# Altium schematic sheet Display.SchDoc: Display
size A4; DrawnBy: Mauro De Bruyn; Revision: 1; SheetNumber: 1; SheetTotal: 5; Number: PXL EAI1_2
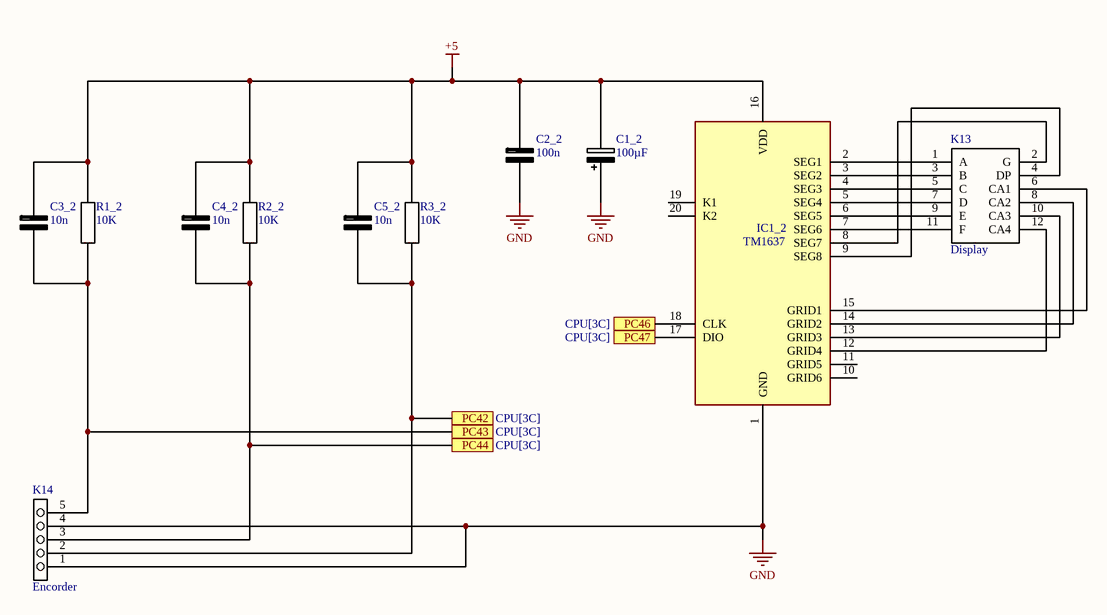
[diagram p0: Display.SchDoc]

## Parts
C1_2  100µF  [CAPPRD350W60D825H1300]
C2_2  100n  [0805]
C3_2  10n  [0805]
C4_2  10n  [0805]
C5_2  10n  [0805]
IC1_2  TM1637  [tm1637]
K13  Display  [HDRV12W64P254_2X6_1524X508X909P]
K14  Encorder  [HDRV5W64P0X254_1X5_1270X254X864P]
R1_2  10K  [0805]
R2_2  10K  [0805]
R3_2  10K  [0805]

## Ports
PC42 (see CPU[3C]), PC43 (see CPU[3C]), PC44 (see CPU[3C]), PC46 (see CPU[3C]), PC47 (see CPU[3C])

## Nets
+5: C1_2.2(-) C2_2.2(-) C3_2.2(-) C4_2.2(-) C5_2.2(-) IC1_2.16(VDD) R1_2.2 R2_2.2 R3_2.2
GND: C1_2.1(+) C2_2.1(+) IC1_2.1(GND) K14.1 K14.4
PC42: C5_2.1(+) K14.2 R3_2.1 ; port PC42
PC43: C3_2.1(+) K14.5 R1_2.1 ; port PC43
PC44: C4_2.1(+) K14.3 R2_2.1 ; port PC44
PC46: IC1_2.18(CLK) ; port PC46
PC47: IC1_2.17(DIO) ; port PC47
NetIC1_2_2: IC1_2.2(SEG1) K13.1(A)
NetIC1_2_3: IC1_2.3(SEG2) K13.3(B)
NetIC1_2_4: IC1_2.4(SEG3) K13.5(C)
NetIC1_2_5: IC1_2.5(SEG4) K13.7(D)
NetIC1_2_6: IC1_2.6(SEG5) K13.9(E)
NetIC1_2_7: IC1_2.7(SEG6) K13.11(F)
NetIC1_2_8: IC1_2.8(SEG7) K13.2(G)
NetIC1_2_9: IC1_2.9(SEG8) K13.4(DP)
NetIC1_2_12: IC1_2.12(GRID4) K13.12(CA4)
NetIC1_2_13: IC1_2.13(GRID3) K13.10(CA3)
NetIC1_2_14: IC1_2.14(GRID2) K13.8(CA2)
NetIC1_2_15: IC1_2.15(GRID1) K13.6(CA1)

Not connected (* = marked no-connect by the designer): IC1_2 10(GRID6) 11(GRID5) 19(K1) 20(K2)

## Library data of the parts
C1_2 = RGA101M1HBK-0811G: Capacitor Polarised; Manufacturer_Name: Lelon; Datasheet Link: https://www.arrow.com/en/products/rga101m1hbk-0811g/lelon-electronics; Height: 13mm; Manufacturer_Part_Number: RGA101M1HBK-0811G
C2_2 C3_2 C4_2 C5_2 = 0805 (Capacitor): Capacitor; Manufacturer_Name: Kemet; Manufacturer_Part_Number: C0805C391G3GACTU; Datasheet Link: https://content.kemet.com/datasheets/KEM_C1003_C0G_SMD.pdf; Height: 1.1mm
IC1_2 = TM1637__SOP_: Integrated Circuit; Manufacturer_Name: TITAN MICRO ELECTRONICS; Manufacturer_Part_Number: TM1637 (SOP); Datasheet Link: https://www.mcielectronics.cl/website_MCI/static/documents/Datasheet_TM1637.pdf; Height: 2.8mm
K13 = 240-062: Connector 12-PIN; Manufacturer_Name: Digilent; Datasheet Link: https://digilent.com/shop/2x6-pin-header-5-pack/; Height: 9.09mm; Manufacturer_Part_Number: 240-062
K14 = M20-9990545: Connector 5-PIN; Manufacturer_Name: Harwin; Datasheet Link: https://componentsearchengine.com//M20-9990545.pdf; Height: 8.64mm; Mouser2 Part Number: 855-M20-9990545; Mouser2 Price/Stock: https://www.mouser.com/Search/Refine.aspx?Keyword=855-M20-9990545; Manufacturer_Part_Number: M20-9990545
R1_2 R2_2 R3_2 = 0805 (Resistor): Resistor; Manufacturer_Name: Kemet; Manufacturer_Part_Number: C0805C391G3GACTU; Datasheet Link: https://content.kemet.com/datasheets/KEM_C1003_C0G_SMD.pdf; Height: 1.1mm